# EAGLE design moduloComunicacao2-portas lógicas (EAGLE 9.5.2)
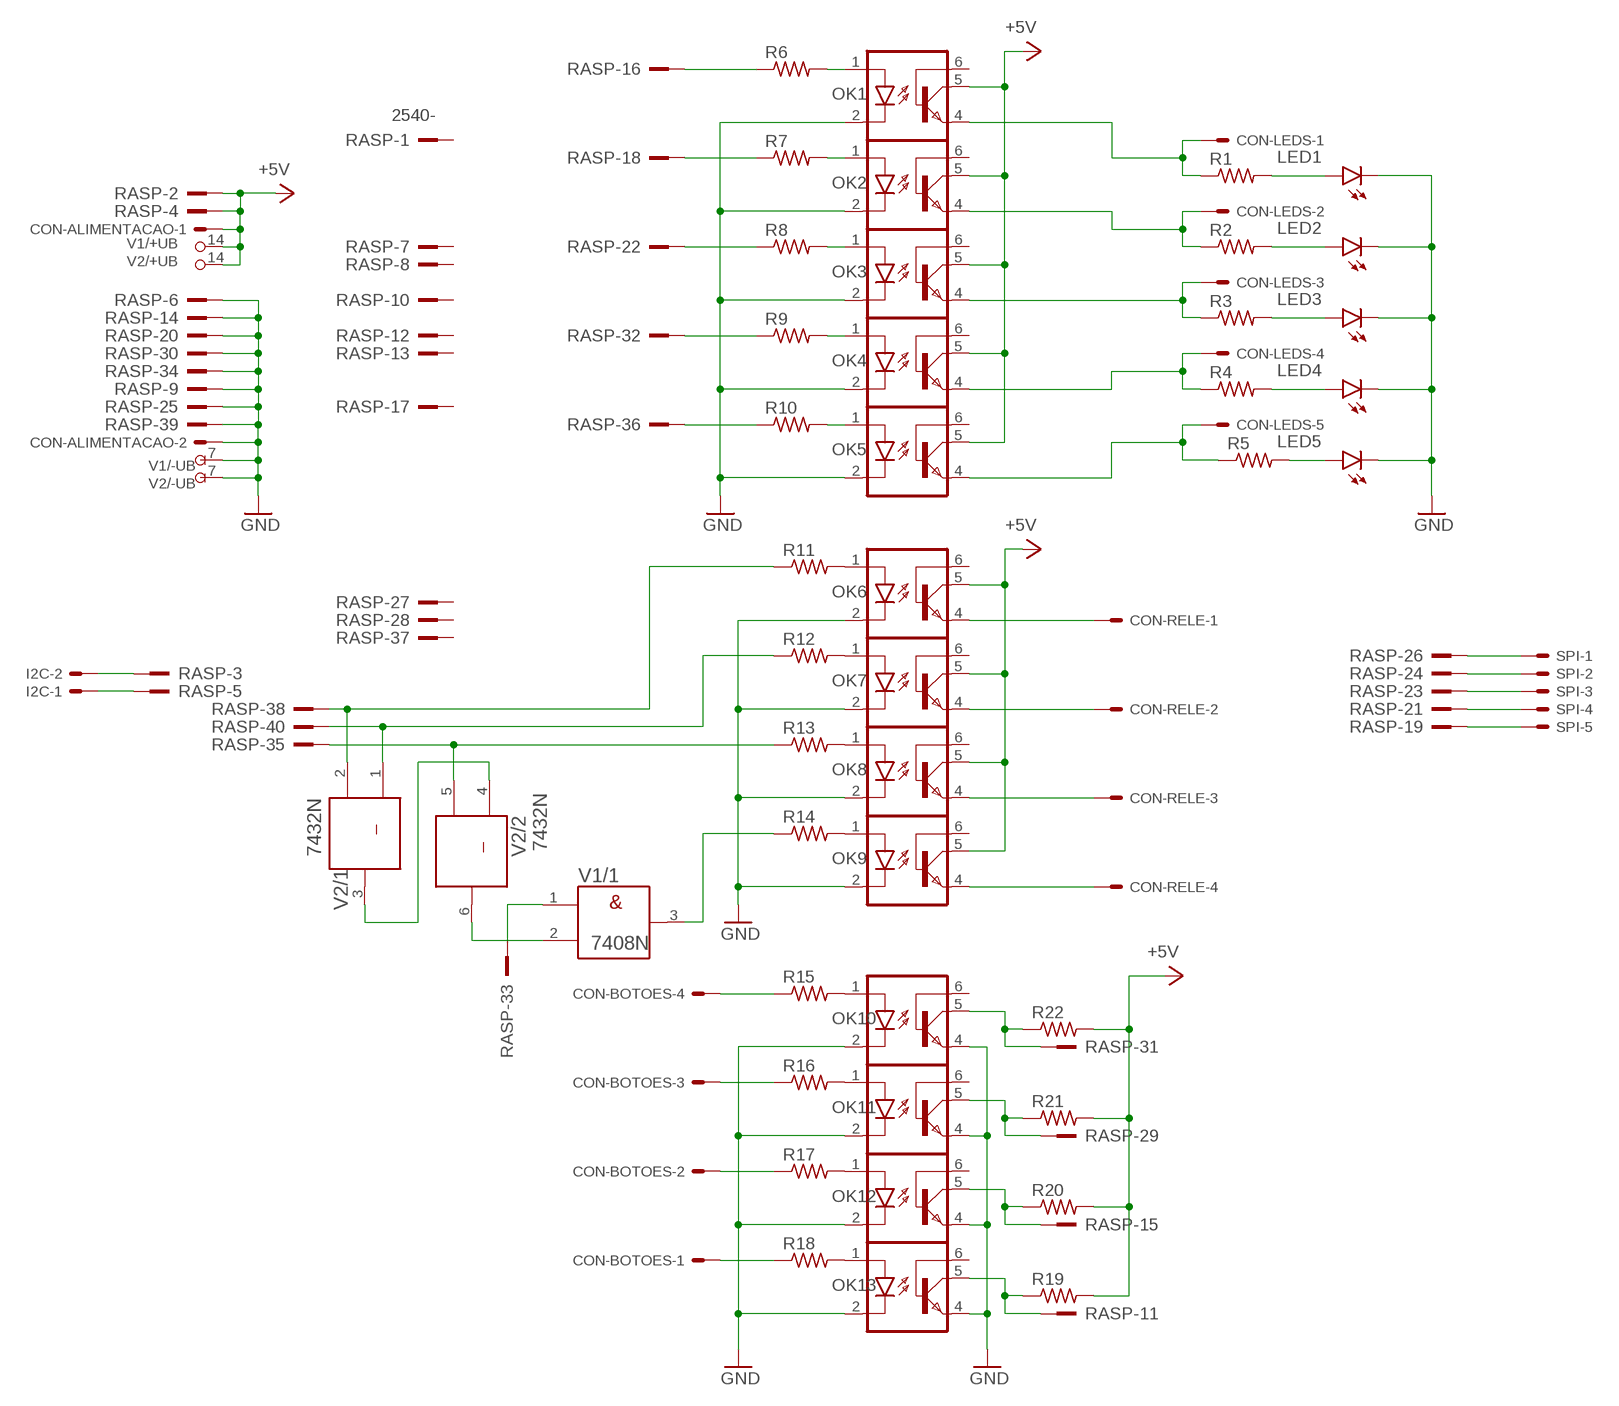
[diagram p0: schematic, sheet 1]

## Parts
CON-ALIMENTACAO  22-23-2021  [22-23-2021]
CON-BOTOES  22-23-2041  [22-23-2041]
CON-LEDS  22-23-2051  [22-23-2051]
CON-RELE  22-23-2041  [22-23-2041]
I2C  22-23-2021  [22-23-2021]
LED1  LED5MM  [LED5MM]
LED2  LED5MM  [LED5MM]
LED3  LED5MM  [LED5MM]
LED4  LED5MM  [LED5MM]
LED5  LED5MM  [LED5MM]
OK1  4N25M  [DIL06]
OK2  4N25M  [DIL06]
OK3  4N25M  [DIL06]
OK4  4N25M  [DIL06]
OK5  4N25M  [DIL06]
OK6  4N25M  [DIL06]
OK7  4N25M  [DIL06]
OK8  4N25M  [DIL06]
OK9  4N25M  [DIL06]
OK10  4N25M  [DIL06]
OK11  4N25M  [DIL06]
OK12  4N25M  [DIL06]
OK13  4N25M  [DIL06]
R1  R-US_0207/12  [0207/12]
R2  R-US_0207/12  [0207/12]
R3  R-US_0207/12  [0207/12]
R4  R-US_0207/12  [0207/12]
R5  R-US_0207/12  [0207/12]
R6  R-US_0204/7  [0204/7]
R7  R-US_0204/7  [0204/7]
R8  R-US_0204/7  [0204/7]
R9  R-US_0204/7  [0204/7]
R10  R-US_0204/7  [0204/7]
R11  R-US_0204/7  [0204/7]
R12  R-US_0204/7  [0204/7]
R13  R-US_0204/7  [0204/7]
R14  R-US_0204/7  [0204/7]
R15  R-US_0207/10  [0207/10]
R16  R-US_0207/10  [0207/10]
R17  R-US_0207/10  [0207/10]
R18  R-US_0207/10  [0207/10]
R19  R-US_0204/7  [0204/7]
R20  R-US_0204/7  [0204/7]
R21  R-US_0204/7  [0204/7]
R22  R-US_0204/7  [0204/7]
RASP  2540-  [PAK100/2500-40]
SPI  22-23-2051  [22-23-2051]
V1  7408N  [DIL14]
V2  7432N  [DIL14]

## Nets
+5V: CON-ALIMENTACAO.1 OK1.5(COL) OK2.5(COL) OK3.5(COL) OK4.5(COL) OK5.5(COL) OK6.5(COL) OK7.5(COL) OK8.5(COL) OK9.5(COL) R19.2 R20.2 R21.2 R22.2 RASP.2 RASP.4 V1.14(/+UB:+UB) V2.14(/+UB:+UB)
GND: CON-ALIMENTACAO.2 LED1.K(C) LED2.K(C) LED3.K(C) LED4.K(C) LED5.K(C) OK1.2(C) OK2.2(C) OK3.2(C) OK4.2(C) OK5.2(C) OK6.2(C) OK7.2(C) OK8.2(C) OK9.2(C) OK10.2(C) OK10.4(EMI) OK11.2(C) OK11.4(EMI) OK12.2(C) OK12.4(EMI) OK13.2(C) OK13.4(EMI) RASP.6 RASP.9 RASP.14 RASP.20 RASP.25 RASP.30 RASP.34 RASP.39 V1.7(/-UB:-UB) V2.7(/-UB:-UB)
N$1: LED1.A R1.2
N$2: LED2.A R2.2
N$3: LED3.A R3.2
N$4: LED4.A R4.2
N$5: LED5.A R5.2
N$6: CON-LEDS.1 OK1.4(EMI) R1.1
N$7: CON-LEDS.2 OK2.4(EMI) R2.1
N$8: CON-LEDS.3 OK3.4(EMI) R3.1
N$9: CON-LEDS.4 OK4.4(EMI) R4.1
N$10: CON-LEDS.5 OK5.4(EMI) R5.1
N$11: CON-RELE.1 OK6.4(EMI)
N$12: CON-RELE.2 OK7.4(EMI)
N$13: OK1.1(A) R6.2
N$14: OK2.1(A) R7.2
N$15: OK3.1(A) R8.2
N$16: OK4.1(A) R9.2
N$17: OK5.1(A) R10.2
N$18: CON-RELE.3 OK8.4(EMI)
N$19: CON-RELE.4 OK9.4(EMI)
N$20: OK6.1(A) R11.2
N$21: OK7.1(A) R12.2
N$22: OK8.1(A) R13.2
N$23: OK9.1(A) R14.2
N$24: OK10.1(A) R15.2
N$25: OK11.1(A) R16.2
N$26: OK12.1(A) R17.2
N$27: OK13.1(A) R18.2
N$28: CON-BOTOES.4 R15.1
N$29: CON-BOTOES.2 R17.1
N$30: CON-BOTOES.3 R16.1
N$31: CON-BOTOES.1 R18.1
N$32: OK13.5(COL) R19.1 RASP.11
N$33: R13.1 RASP.35 V2.5(/2:B)
N$34: OK12.5(COL) R20.1 RASP.15
N$35: R12.1 RASP.40 V2.1(/1:A)
N$36: OK11.5(COL) R21.1 RASP.29
N$37: R14.1 V1.3(/1:Y)
N$38: OK10.5(COL) R22.1 RASP.31
N$39: R11.1 RASP.38 V2.2(/1:B)
N$40: R6.1 RASP.16
N$41: R7.1 RASP.18
N$42: R8.1 RASP.22
N$43: R9.1 RASP.32
N$44: R10.1 RASP.36
N$45: I2C.2 RASP.3
N$46: I2C.1 RASP.5
N$47: RASP.33 V1.1(/1:A)
N$48: V2.3(/1:Y) V2.4(/2:A)
N$49: V1.2(/1:B) V2.6(/2:Y)
N$50: RASP.26 SPI.1
N$51: RASP.24 SPI.2
N$52: RASP.23 SPI.3
N$53: RASP.21 SPI.4
N$54: RASP.19 SPI.5
Unconnected: OK1.6(BAS) OK2.6(BAS) OK3.6(BAS) OK4.6(BAS) OK5.6(BAS) OK6.6(BAS) OK7.6(BAS) OK8.6(BAS) OK9.6(BAS) OK10.6(BAS) OK11.6(BAS) OK12.6(BAS) OK13.6(BAS) RASP.1 RASP.7 RASP.8 RASP.10 RASP.12 RASP.13 RASP.17 RASP.27 RASP.28 RASP.37 V1.4(/2:A) V1.5(/2:B) V1.6(/2:Y) V1.8(/3:Y) V1.9(/3:A) V1.10(/3:B) V1.11(/4:Y) V1.12(/4:A) V1.13(/4:B) V2.8(/3:Y) V2.9(/3:A) V2.10(/3:B) V2.11(/4:Y) V2.12(/4:A) V2.13(/4:B)

## Library data of the parts
CON-ALIMENTACAO I2C = con-molex:22-23-2021: .100" (2.54mm) Center Header - 2 Pin; MF: MOLEX; MPN: 22-23-2021; OC_FARNELL: 1462926; OC_NEWARK: 25C3832
CON-BOTOES CON-RELE = con-molex:22-23-2041: .100" (2.54mm) Center Header - 4 Pin; MF: MOLEX; MPN: 22-23-2041; OC_FARNELL: 1462920; OC_NEWARK: 38C0355
CON-LEDS SPI = con-molex:22-23-2051: .100" (2.54mm) Center Header - 5 Pin; MF: MOLEX; MPN: 22-23-2051; OC_FARNELL: 1462952; OC_NEWARK: 38C9178
LED1-LED5 = led:LED: LED OSRAM: - CHIPLED LG R971, LG N971, LY N971, LG Q971, LY Q971, LO R971, LY R971 LH N974, LH R974 LS Q976, LO Q976, LY Q976 LO Q996 - Hyper CHIPLED LW Q18S LB Q993, LB Q99A, LB R99A - SideLED LS A670, LO A670, LY A670, LG A670, LP A670 LB A673, LV A673, LT A673, LW A673 LH A674 LY A675 LS A676, LA A676, LO A676, LY A676, LW A676 LS A679, LY A679, LG A679 - Hyper Micro SIDELED® LS Y876, LA Y876, LO Y876, LY Y876 LT Y87S - SmartLED LW L88C, LW L88S LB L89C, LB L89S, LG L890 LS L89K, LO L89K, LY L89K LS L896, LA L896, LO L896, LY L896 - TOPLED LS T670, LO T670, LY T670, LG T670, LP T670 LSG T670, LSP T670, LSY T670, LOP T670, LYG T670 LG T671, LOG T671, LSG T671 LB T673, LV T673, LT T673, LW T673 LH T674 LS T676, LA T676, LO T676, LY T676, LB T676, LH T676, LSB T676, LW T676 LB T67C, LV T67C, LT T67C, LS T67K, LO T67K, LY T67K, LW E67C LS E67B, LA E67B, LO E67B, LY E67B, LB E67C, LV E67C, LT E67C LW T67C LS T679, LY T679, LG T679 LS T770, LO T770, LY T770, LG T770, LP T770 LB T773, LV T773, LT T773, LW T773 LH T774 LS E675, LA E675, LY E675, LS T675 LS T776, LA T776, LO T776, LY T776, LB T776 LHGB T686 LT T68C, LB T68C - Hyper Mini TOPLED® LB M676 - Mini TOPLED Santana® LG M470 LS M47K, LO M47K, LY M47K Source: http://www.osram.convergy.de LUXEON: - LUMILED® LXK2-PW12-R00, LXK2-PW12-S00, LXK2-PW14-U00, LXK2-PW14-V00 LXK2-PM12-R00, LXK2-PM12-S00, LXK2-PM14-U00 LXK2-PE12-Q00, LXK2-PE12-R00, LXK2-PE12-S00, LXK2-PE14-T00, LXK2-PE14-U00 LXK2-PB12-K00, LXK2-PB12-L00, LXK2-PB12-M00, LXK2-PB14-N00, LXK2-PB14-P00, LXK2-PB14-Q00 LXK2-PR12-L00, LXK2-PR12-M00, LXK2-PR14-Q00, LXK2-PR14-R00 LXK2-PD12-Q00, LXK2-PD12-R00, LXK2-PD12-S00 LXK2-PH12-R00, LXK2-PH12-S00 LXK2-PL12-P00, LXK2-PL12-Q00, LXK2-PL12-R00 Source: www.luxeon.com KINGBRIGHT: KA-3528ASYC Source: www.kingbright.com
OK1-OK13 = optocoupler:4N*?M: General Purpose 6-Pin Phototransistor Optocouplers Source: http://www.fairchildsemi.com/ds/4N/4N35-M.pdf; MPN: 4N25-M; OC_FARNELL: 1021349; OC_NEWARK: 98K9084
R1-R22 = rcl:R-US_: RESISTOR, American symbol; SPICEPREFIX: R
RASP = con-3m:2540-: 3M (TM) Pak 100 4-Wall Header Source: 3M; OC_FARNELL: unknown; OC_NEWARK: unknown
V1 = 74ttl-din:74*08: Quad 2-input AND gate
V2 = 74ttl-din:74*32: Quad 2-input OR gate

## Board
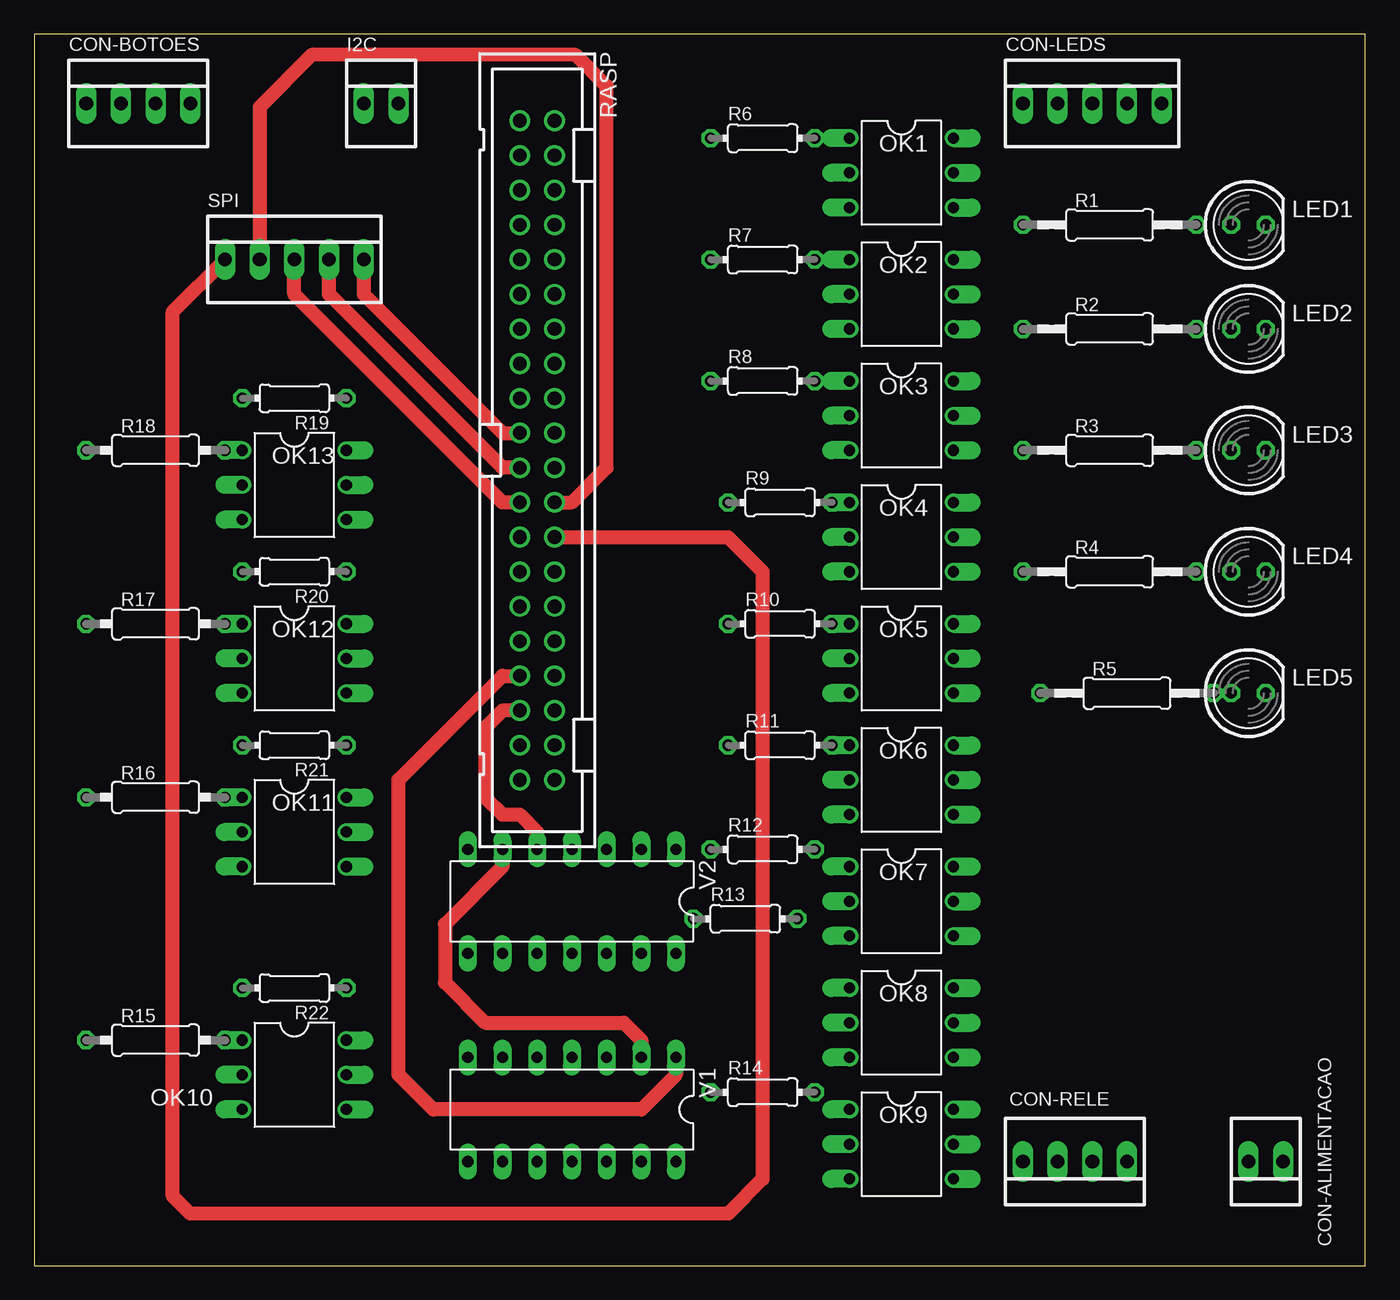
[diagram p1: board, top side]
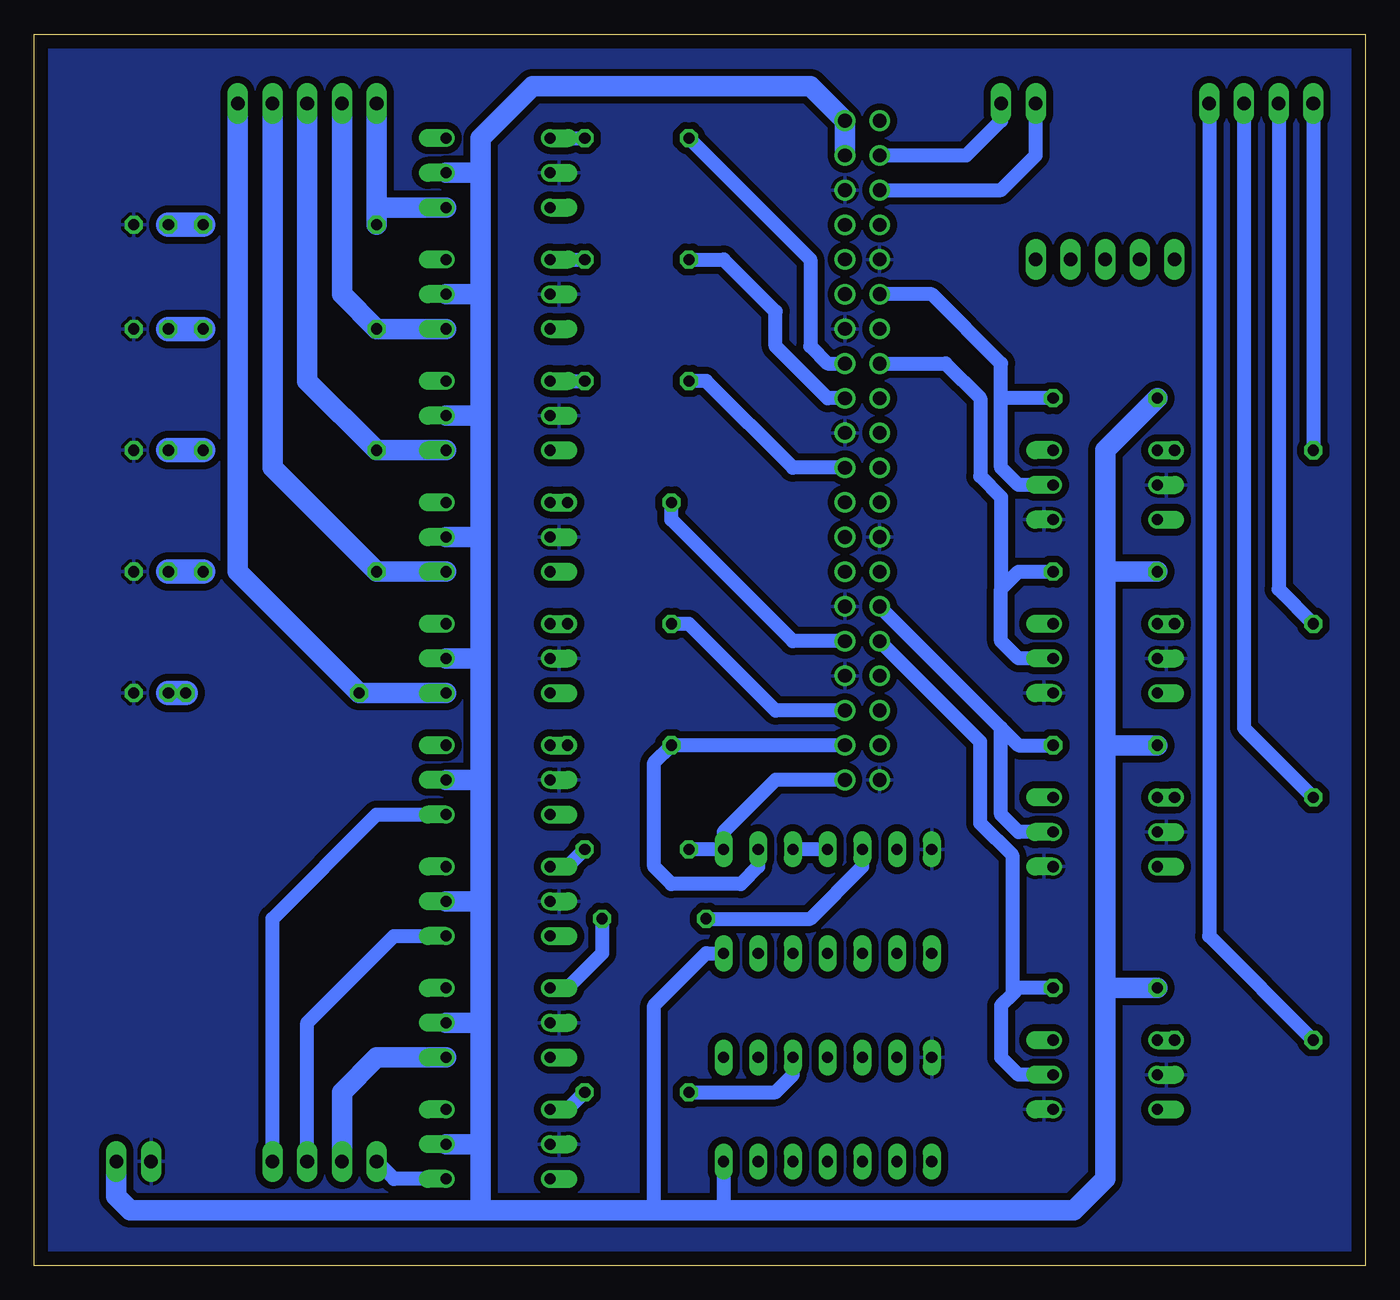
[diagram p2: board, bottom side, seen from below]

Size 97.46 x 90.16 mm. Coordinates in mm from the lower left corner, seen from the top.
Outline: 0,0 97.46,0 97.46,90.16 0,90.16 0,0
Copper layers (1*16): Top 0.035mm / dielectric 1.5mm / Bottom 0.035mm
Design rules "default *": minimum track width 6mil, minimum drill 0.35mm, track to track 20mil, track to pad 20mil, pad to pad 20mil, via to via 20mil, smd to smd 6mil, copper to edge 40mil, drill to drill 6mil, minimum pad ring 10mil, minimum via ring 8mil, stop-mask expansion 4mil, vias tented up to drill 0mil, thermal gap 10mil

### Footprints (pad centres in the part's own frame; a part is rotated, then mirrored left to right if it is on the bottom)
22-23-2021 = drill 1 long: 1 -1.27,0; 2 1.27,0
22-23-2041 = drill 1 long: 1 -3.81,0; 2 -1.27,0; 3 1.27,0; 4 3.81,0
22-23-2051 = drill 1 long: 1 -5.08,0; 2 -2.54,0; 3 0,0; 4 2.54,0; 5 5.08,0
LED5MM = drill 0.813 octagon: A -1.27,0; K 1.27,0
DIL06 = drill 0.813 offset: 1 -2.54,-3.81; 2 0,-3.81; 3 2.54,-3.81; 4 2.54,3.81; 5 0,3.81; 6 -2.54,3.81
0207/12 = drill 0.813 octagon: 1 -6.35,0; 2 6.35,0
0204/7 = drill 0.813 octagon: 1 -3.81,0; 2 3.81,0
0207/10 = drill 0.813 octagon: 1 -5.08,0; 2 5.08,0
PAK100/2500-40 = drill 1 pad 1.422: 1 -24.13,-1.27; 2 -24.13,1.27; 3 -21.59,-1.27; 4 -21.59,1.27; 5 -19.05,-1.27; 6 -19.05,1.27; 7 -16.51,-1.27; 8 -16.51,1.27; 9 -13.97,-1.27; 10 -13.97,1.27; 11 -11.43,-1.27; 12 -11.43,1.27; 13 -8.89,-1.27; 14 -8.89,1.27; 15 -6.35,-1.27; 16 -6.35,1.27; 17 -3.81,-1.27; 18 -3.81,1.27; 19 -1.27,-1.27; 20 -1.27,1.27; 21 1.27,-1.27; 22 1.27,1.27; 23 3.81,-1.27; 24 3.81,1.27; 25 6.35,-1.27; 26 6.35,1.27; 27 8.89,-1.27; 28 8.89,1.27; 29 11.43,-1.27; 30 11.43,1.27; 31 13.97,-1.27; 32 13.97,1.27; 33 16.51,-1.27; 34 16.51,1.27; 35 19.05,-1.27; 36 19.05,1.27; 37 21.59,-1.27; 38 21.59,1.27; 39 24.13,-1.27; 40 24.13,1.27
DIL14 = drill 0.813 long: 1 -7.62,-3.81; 2 -5.08,-3.81; 3 -2.54,-3.81; 4 0,-3.81; 5 2.54,-3.81; 6 5.08,-3.81; 7 7.62,-3.81; 8 7.62,3.81; 9 5.08,3.81; 10 2.54,3.81; 11 0,3.81; 12 -2.54,3.81; 13 -5.08,3.81; 14 -7.62,3.81

### Placement (x,y rotation side)
CON-ALIMENTACAO  90.17,7.62 180 top
CON-BOTOES  7.62,85.09 0 top
CON-LEDS  77.47,85.09 0 top
CON-RELE  76.2,7.62 180 top
I2C  25.4,85.09 0 top
LED1  88.9,76.2 0 top
LED2  88.9,68.58 0 top
LED3  88.9,59.69 0 top
LED4  88.9,50.8 0 top
LED5  88.9,41.91 0 top
OK1  63.5,80.01 270 top
OK2  63.5,71.12 270 top
OK3  63.5,62.23 270 top
OK4  63.5,53.34 270 top
OK5  63.5,44.45 270 top
OK6  63.5,35.56 270 top
OK7  63.5,26.67 270 top
OK8  63.5,17.78 270 top
OK9  63.5,8.89 270 top
OK10  19.05,13.97 270 top
OK11  19.05,31.75 270 top
OK12  19.05,44.45 270 top
OK13  19.05,57.15 270 top
R1  78.74,76.2 0 top
R2  78.74,68.58 0 top
R3  78.74,59.69 0 top
R4  78.74,50.8 0 top
R5  80.01,41.91 0 top
R6  53.34,82.55 0 top
R7  53.34,73.66 0 top
R8  53.34,64.77 0 top
R9  54.61,55.88 0 top
R10  54.61,46.99 0 top
R11  54.61,38.1 0 top
R12  53.34,30.48 0 top
R13  52.07,25.4 0 top
R14  53.34,12.7 0 top
R15  8.89,16.51 0 top
R16  8.89,34.29 0 top
R17  8.89,46.99 0 top
R18  8.89,59.69 0 top
R19  19.05,63.5 180 top
R20  19.05,50.8 180 top
R21  19.05,38.1 180 top
R22  19.05,20.32 180 top
RASP  36.83,59.69 270 top
SPI  19.05,73.66 0 top
V1  39.37,11.43 180 top
V2  39.37,26.67 180 top

### Tracks (layer width: path | path; a pad name or v marks a point on that pad's centre or on a via)
+5V
  Bottom 1.016: V1.14 46.99,4.06 | 52.07,4.06 52.07,19.05 48.26,22.86 V2.14
  Bottom 1.5: 64.77,4.06 52.07,4.06 46.99,4.06 21.34,4.06 19.05,6.35 19.05,20.32 | 64.77,4.06 90.42,4.06 91.44,5.08 CON-ALIMENTACAO.1 | 64.77,80.01 64.77,82.55 60.96,86.36 40.64,86.36 RASP.2 RASP.4 | 64.77,80.01 64.77,71.12 | 64.77,71.12 64.77,62.23 | 64.77,62.23 64.77,53.34 | 64.77,53.34 64.77,44.45 | 64.77,44.45 64.77,35.56 | 64.77,35.56 64.77,26.67 | 64.77,26.67 64.77,17.78 | 64.77,17.78 64.77,8.89 | 64.77,8.89 64.77,4.06 | OK9.5 64.77,8.89 | OK8.5 64.77,17.78 | OK7.5 64.77,26.67 | OK6.5 64.77,35.56 | OK5.5 64.77,44.45 | OK4.5 64.77,53.34 | OK3.5 64.77,62.23 | OK2.5 64.77,71.12 | OK1.5 64.77,80.01 | R19.2 19.05,59.69 19.05,50.8 | 19.05,50.8 19.05,38.1 | 19.05,38.1 19.05,20.32 | R20.2 19.05,50.8 | R22.2 19.05,20.32 | R21.2 19.05,38.1
GND
  pour Bottom: 0,90.17 97.79,90.17 97.79,0 0,0
N$1
  Bottom 1.8: R1.2 LED1.A
N$2
  Bottom 1.8: R2.2 LED2.A
N$3
  Bottom 1.8: R3.2 LED3.A
N$4
  Bottom 1.8: R4.2 LED4.A
N$5
  Bottom 1.8: R5.2 LED5.A
N$6
  Bottom 1.5: CON-LEDS.1 72.39,77.47 | 72.39,77.47 R1.1 | OK1.4 72.39,77.47
N$7
  Bottom 1.5: CON-LEDS.2 74.93,71.12 R2.1 OK2.4
N$8
  Bottom 1.5: OK3.4 R3.1 77.47,64.77 CON-LEDS.3
N$9
  Bottom 1.5: CON-LEDS.4 80.01,58.42 R4.1 OK4.4
N$10
  Bottom 1.5: CON-LEDS.5 82.55,50.8 R5.1 OK5.4
N$11
  Bottom 1.016: CON-RELE.1 80.01,25.4 72.39,33.02 OK6.4
N$12
  Bottom 1.016: CON-RELE.2 77.47,17.78 71.12,24.13 OK7.4
N$13
  Bottom 1.016: OK1.1 R6.2
N$14
  Bottom 1.016: OK2.1 R7.2
N$15
  Bottom 1.016: OK3.1 R8.2
N$16
  Bottom 1.016: OK4.1 R9.2
N$17
  Bottom 1.016: R10.2 OK5.1
N$18
  Bottom 1.5: OK8.4 72.39,15.24 74.93,12.7 CON-RELE.3
N$19
  Bottom 1.016: OK9.4 71.12,6.35 CON-RELE.4
N$20
  Bottom 1.016: R11.2 OK6.1
N$21
  Bottom 1.016: R12.2 58.42,29.21 OK7.1
N$22
  Bottom 1.016: OK8.1 58.42,20.32 55.88,22.86 R13.2
N$23
  Bottom 1.016: OK9.1 58.42,11.43 R14.2
N$24
  Bottom 1.016: OK10.1 R15.2
N$25
  Bottom 1.016: OK11.1 R16.2
N$26
  Bottom 1.016: OK12.1 R17.2
N$27
  Bottom 1.016: OK13.1 R18.2
N$28
  Bottom 1.016: CON-BOTOES.4 11.43,24.13 R15.1
N$29
  Bottom 1.016: CON-BOTOES.2 6.35,49.53 R17.1
N$30
  Bottom 1.016: CON-BOTOES.3 8.89,39.37 R16.1
N$31
  Bottom 1.016: CON-BOTOES.1 R18.1
N$32
  Bottom 1.016: OK13.5 25.4,57.15 26.67,58.42 26.67,63.5 | RASP.11 31.75,71.12 26.67,66.04 26.67,63.5 | R19.1 26.67,63.5
N$33
  Top 1.016: RASP.35 34.29,40.64 33.02,39.37 33.02,34.29 34.29,33.02 35.56,33.02 36.83,31.75 V2.5
  Bottom 1.016: R13.1 40.64,25.4 36.83,29.21 V2.5
N$34
  Bottom 1.016: OK12.5 25.4,44.45 26.67,45.72 26.67,49.53 | 26.67,49.53 25.4,50.8 R20.1 | RASP.15 30.73,66.04 28.19,63.5 28.19,57.79 26.67,56.27 26.67,49.53
N$35
  Bottom 1.016: RASP.40 43.18,35.56 46.99,31.75 V2.1 R12.1
N$36
  Bottom 1.016: 26.67,39.37 25.4,38.1 R21.1 | OK11.5 25.4,31.75 26.67,33.02 26.67,39.37 | 26.67,39.37 RASP.29
N$37
  Bottom 1.016: R14.1 43.18,12.7 41.91,13.97 V1.3
N$38
  Bottom 1.016: OK10.5 25.4,13.97 26.67,15.24 26.67,19.05 25.86,19.86 | 25.86,19.86 25.4,20.32 R22.1 | 25.86,19.86 25.86,30.05 28.19,32.39 28.19,38.35 RASP.31
N$39
  Bottom 1.016: RASP.38 R11.1 52.07,36.83 52.07,29.21 50.8,27.94 45.72,27.94 44.45,29.21 V2.2
N$40
  Bottom 1.016: R6.1 40.64,73.66 40.64,67.31 39.37,66.04 RASP.16
N$41
  Bottom 1.016: R7.1 46.99,73.66 43.18,69.85 43.18,67.31 39.37,63.5 RASP.18
N$42
  Bottom 1.016: R8.1 48.26,64.77 41.91,58.42 RASP.22
N$43
  Bottom 1.016: R9.1 50.8,54.61 41.91,45.72 RASP.32
N$44
  Bottom 1.016: R10.1 49.53,46.99 43.18,40.64 RASP.36
N$45
  Bottom 1.016: RASP.3 29.21,81.28 26.67,83.82 I2C.2
N$46
  Bottom 1.016: RASP.5 26.67,78.74 24.13,81.28 I2C.1
N$47
  Top 1.016: V1.1 46.99,13.97 44.45,11.43 29.21,11.43 26.67,13.97 26.67,35.56 34.29,43.18 RASP.33
N$48
  Bottom 1.016: V2.4 V2.3
N$49
  Top 1.016: V2.6 34.29,29.21 30.07,24.99 30.07,20.73 33.02,17.78 43.18,17.78 44.45,16.51 V1.2
N$50
  Top 1.016: RASP.26 50.8,53.34 53.34,50.8 53.34,6.35 50.8,3.81 11.43,3.81 10.16,5.08 10.16,69.85 SPI.1
N$51
  Top 1.016: RASP.24 39.37,55.88 41.91,58.42 41.91,86.36 39.63,88.64 20.32,88.64 16.51,84.83 SPI.2
N$52
  Top 1.016: RASP.23 34.29,55.88 19.05,71.12 SPI.3
N$53
  Top 1.016: RASP.21 34.29,58.42 21.59,71.12 SPI.4
N$54
  Top 1.016: SPI.5 24.13,71.12 34.29,60.96 RASP.19